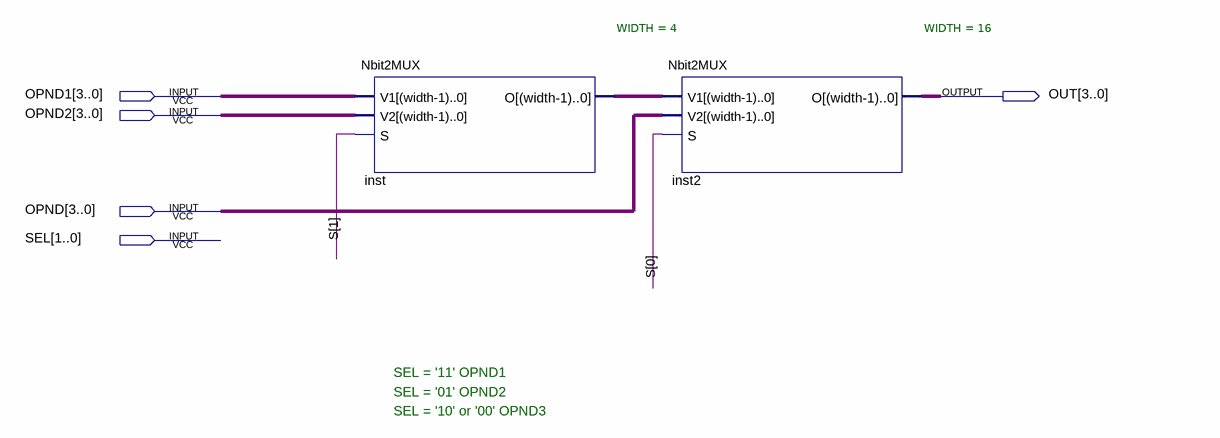
[diagram p0: schematic sheet]
// Quartus schematic 4bit3_1MUX.bdf as structural Verilog: 2 symbols, 5 pins
module \4bit3_1MUX  (
  input  [3:0] OPND1,
  input  [3:0] OPND2,
  input  [3:0] OPND,
  input  [1:0] SEL,
  output [3:0] OUT
);

  wire [1:0] S;
  wire [15:0] inst_o;

  Nbit2MUX #(.WIDTH(4)) inst (.V1(OPND1), .V2(OPND2), .S(S[1]), .O(inst_o));
  Nbit2MUX #(.WIDTH(16)) inst2 (.V1(inst_o), .V2(OPND), .S(S[0]), .O(OUT));

  // Notes on the sheet:
  //   SEL = '11' OPND1
  //   SEL = '01' OPND2
  //   SEL = '10' or '00' OPND3
endmodule
